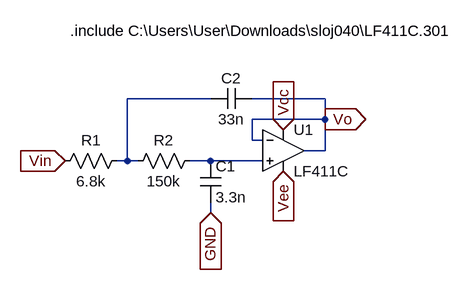
[diagram p0: schematic Lowpass.asc]
Lowpass.asc, the LTspice schematic file:
Version 4
SHEET 1 880 680
WIRE 144 64 16 64
WIRE 320 64 208 64
WIRE 320 96 320 64
WIRE 320 96 208 96
WIRE 208 128 208 96
WIRE 224 128 208 128
WIRE 320 144 320 96
WIRE 320 144 288 144
WIRE 16 160 16 64
WIRE 16 160 0 160
WIRE 32 160 16 160
WIRE 144 160 112 160
WIRE 224 160 144 160
WIRE 144 240 144 224
FLAG -80 160 Vin
IOPIN -80 160 In
FLAG 256 112 Vcc
IOPIN 256 112 In
FLAG 256 176 Vee
IOPIN 256 176 In
FLAG 320 96 Vo
IOPIN 320 96 Out
FLAG 144 240 GND
IOPIN 144 240 In
SYMBOL res 16 144 R90
WINDOW 0 0 56 VBottom 2
WINDOW 3 32 56 VTop 2
SYMATTR InstName R1
SYMATTR Value 6.8k
SYMBOL res 128 144 R90
WINDOW 0 0 56 VBottom 2
WINDOW 3 32 56 VTop 2
SYMATTR InstName R2
SYMATTR Value 150k
SYMBOL cap 128 160 R0
SYMATTR InstName C1
SYMATTR Value 3.3n
SYMBOL cap 208 48 R90
WINDOW 0 0 32 VBottom 2
WINDOW 3 32 32 VTop 2
SYMATTR InstName C2
SYMATTR Value 33n
SYMBOL OpAmps\\opamp2 256 80 R0
SYMATTR InstName U1
SYMATTR Value LF411C
TEXT -72 -40 Left 2 !.include C:\\Users\\User\\Downloads\\sloj040\\LF411C.301

The netlist it stands for:
* Lowpass.asc
R1 N001 Vin 6.8k
R2 N002 N001 150k
C1 N002 GND 3.3n
C2 Vo N001 33n
XU1 N002 Vo Vcc Vee Vo LF411C  ; pins In+ In- V+ V- OUT
.include C:\Users\User\Downloads\sloj040\LF411C.301
.backanno
.end